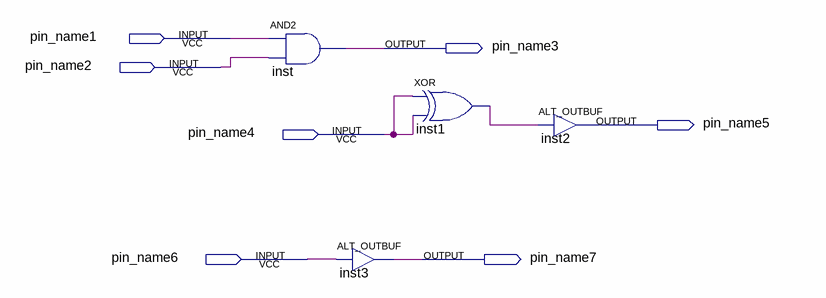
[diagram p0: schematic sheet]
// Quartus schematic First_in_curse.bdf as structural Verilog: 4 symbols, 7 pins
module First_in_curse (
  input  pin_name1,
  input  pin_name2,
  input  pin_name4,
  input  pin_name6,
  output pin_name3,
  output pin_name5,
  output pin_name7
);

  wire inst1_out;

  and inst (pin_name3, pin_name1, pin_name2);
  ALT_OUTBUF inst3 (.i(pin_name6), .o(pin_name7));
  xor inst1 (inst1_out, pin_name4, pin_name4);
  ALT_OUTBUF inst2 (.i(inst1_out), .o(pin_name5));
endmodule
